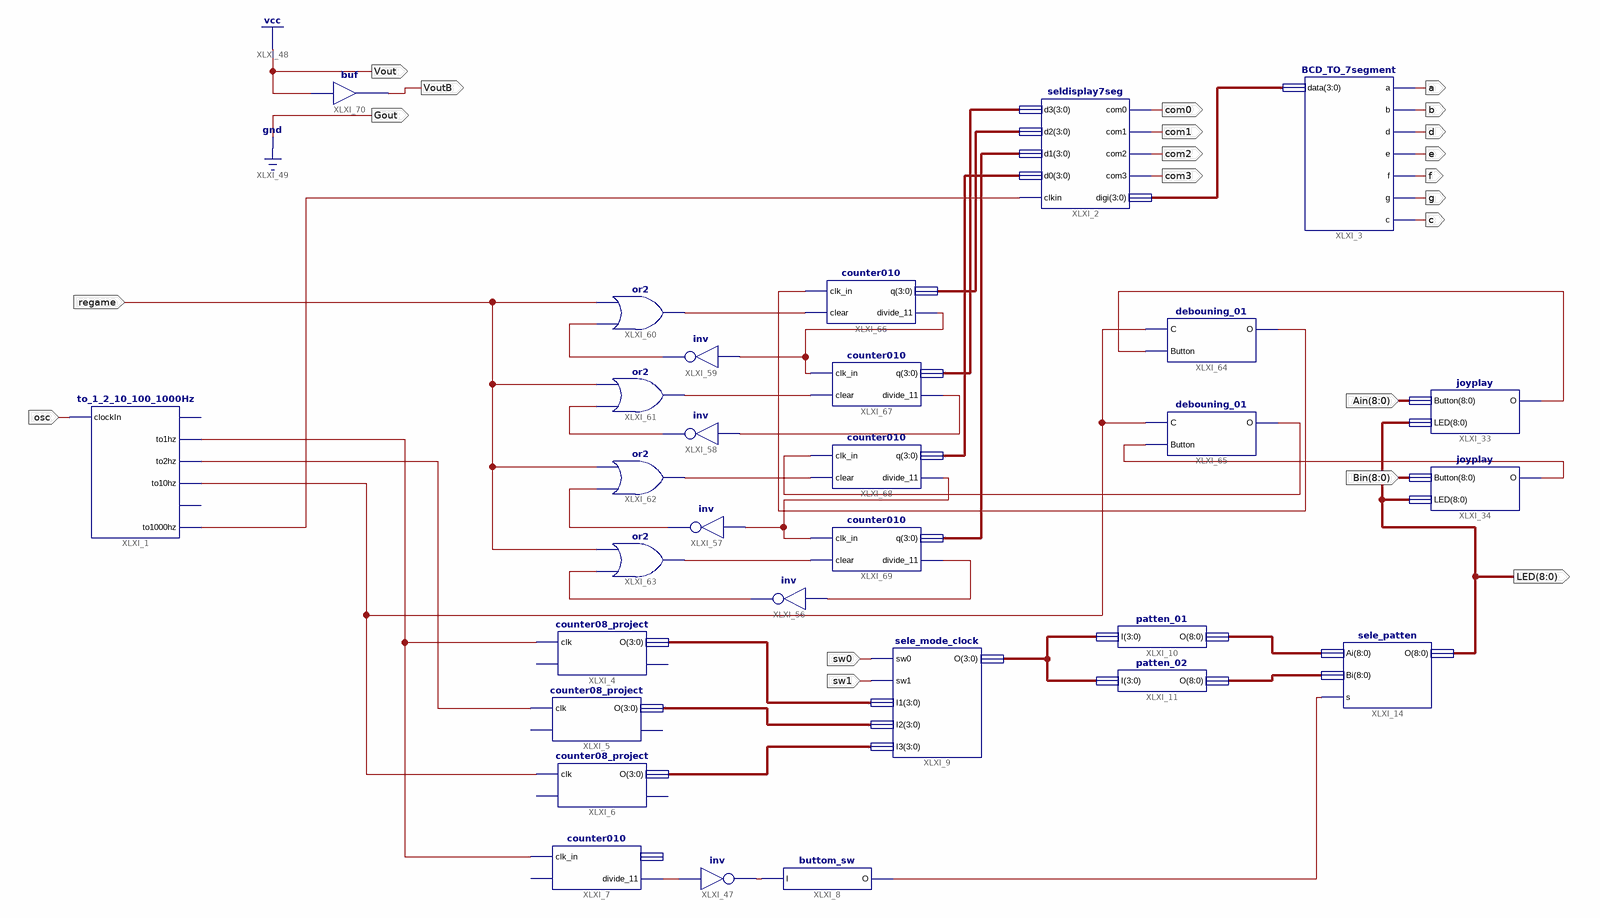
[diagram p0: schematic sheet 1]
// Xilinx ISE schematic main.sch (spartan6) as structural Verilog: 30 symbols, 21 ports
module main (
  input  [8:0] Ain,
  input  [8:0] Bin,
  input  sw0,
  input  sw1,
  input  osc,
  input  regame,
  output [8:0] LED,
  output com0,
  output com1,
  output com2,
  output com3,
  output a,
  output b,
  output d,
  output e,
  output f,
  output g,
  output c,
  output Gout,
  output Vout,
  output VoutB
);

  wire XLXN_1, XLXN_13, XLXN_15, XLXN_17, XLXN_18, XLXN_19, XLXN_26, XLXN_53, XLXN_54, XLXN_73, XLXN_74,
       XLXN_75, XLXN_76, XLXN_77, XLXN_78, XLXN_79, XLXN_80, XLXN_82, XLXN_83, XLXN_88, XLXN_89, XLXN_90,
       XLXN_91;
  wire [3:0] XLXN_2, XLXN_3, XLXN_11, XLXN_12, XLXN_16, XLXN_23, XLXN_24, XLXN_25, XLXN_28;
  wire [8:0] XLXN_29, XLXN_30;

  counter08_project XLXI_4 (.clk(XLXN_17), .O(XLXN_23));  // open: claer, dev8
  counter08_project XLXI_5 (.clk(XLXN_18), .O(XLXN_24));  // open: claer, dev8
  counter08_project XLXI_6 (.clk(XLXN_19), .O(XLXN_25));  // open: claer, dev8
  counter010 XLXI_7 (.clk_in(XLXN_17), .divide_11(XLXN_54));  // open: clear, q
  buttom_sw XLXI_8 (.I(XLXN_53), .O(XLXN_26));
  sele_mode_clock XLXI_9 (.sw0(sw0), .sw1(sw1), .I1(XLXN_23), .I2(XLXN_24), .I3(XLXN_25), .O(XLXN_28));
  sele_patten XLXI_14 (.Ai(XLXN_29), .Bi(XLXN_30), .s(XLXN_26), .O(LED));
  joyplay XLXI_33 (.Button(Ain), .LED(LED), .O(XLXN_88));
  joyplay XLXI_34 (.Button(Bin), .LED(LED), .O(XLXN_89));
  seldisplay7seg XLXI_2 (
    .d3(XLXN_12), .d2(XLXN_3), .d1(XLXN_11), .d0(XLXN_16), .clkin(XLXN_1), .com0(com0), .com1(com1),
    .com2(com2), .com3(com3), .digi(XLXN_2));
  BCD_TO_7segment XLXI_3 (.data(XLXN_2), .a(a), .b(b), .d(d), .e(e), .f(f), .g(g), .c(c));
  patten_01 XLXI_10 (.I(XLXN_28), .O(XLXN_29));
  patten_02 XLXI_11 (.I(XLXN_28), .O(XLXN_30));
  not XLXI_47 (XLXN_53, XLXN_54);
  to_1_2_10_100_1000Hz XLXI_1 (
    .clockIn(osc), .to1hz(XLXN_17), .to2hz(XLXN_18), .to10hz(XLXN_19), .to1000hz(XLXN_1));  // open: to100hz, zero_5hz
  not XLXI_56 (XLXN_74, XLXN_73);
  not XLXI_57 (XLXN_76, XLXN_15);
  not XLXI_58 (XLXN_79, XLXN_78);
  not XLXI_59 (XLXN_82, XLXN_13);
  or XLXI_60 (XLXN_83, XLXN_82, regame);
  or XLXI_61 (XLXN_80, XLXN_79, regame);
  or XLXI_62 (XLXN_77, XLXN_76, regame);
  or XLXI_63 (XLXN_75, XLXN_74, regame);
  debouning_01 XLXI_64 (.C(XLXN_19), .Button(XLXN_88), .O(XLXN_90));
  debouning_01 XLXI_65 (.C(XLXN_19), .Button(XLXN_89), .O(XLXN_91));
  counter010 XLXI_66 (.clk_in(XLXN_90), .clear(XLXN_83), .q(XLXN_3), .divide_11(XLXN_13));
  counter010 XLXI_67 (.clk_in(XLXN_13), .clear(XLXN_80), .q(XLXN_12), .divide_11(XLXN_78));
  counter010 XLXI_68 (.clk_in(XLXN_91), .clear(XLXN_77), .q(XLXN_16), .divide_11(XLXN_15));
  counter010 XLXI_69 (.clk_in(XLXN_15), .clear(XLXN_75), .q(XLXN_11), .divide_11(XLXN_73));
  buf XLXI_70 (VoutB, 1'b1);

  assign Gout = 1'b0;
  assign Vout = 1'b1;
endmodule
